# Altium schematic sheet Open lid.SchDoc
size A
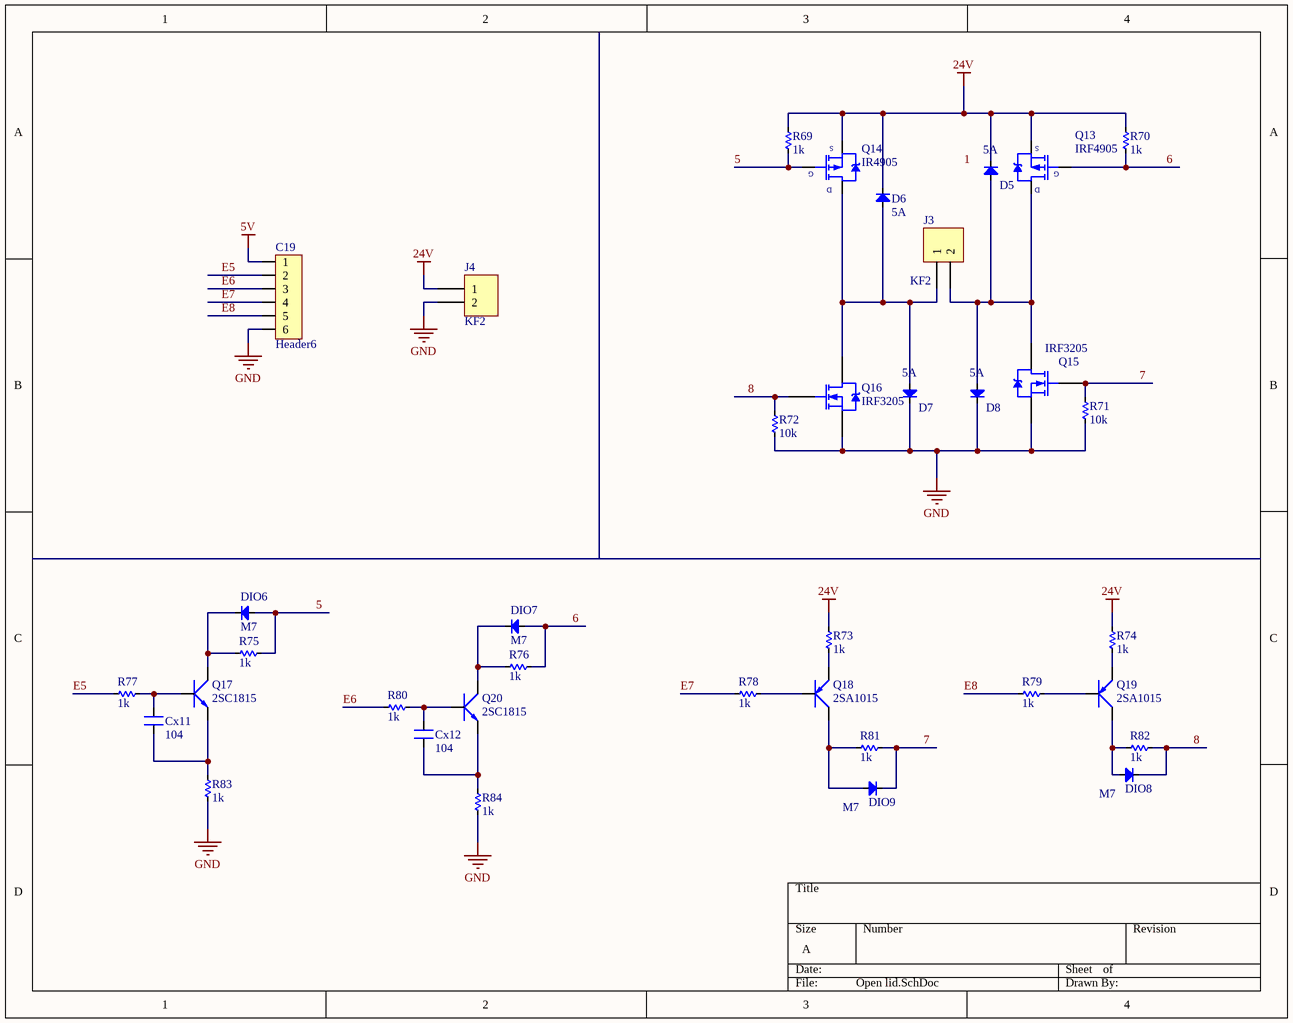
[diagram p0: Open lid.SchDoc]

## Parts
C19  Header6  [HDR6]
Cx11  104  [CN-SMD-0805]
Cx12  104  [CN-SMD-0805]
D5  5A  [DIO-5A]
D6  5A  [DIO-5A]
D7  5A  [DIO-5A]
D8  5A  [DIO-5A]
DIO6  M7  [DIO-SMD-106]
DIO7  M7  [DIO-SMD-106]
DIO8  M7  [DIO-SMD-106]
DIO9  M7  [DIO-SMD-106]
J3  KF2  [KF2-7.62]
J4  KF2  [KF2-7.62]
Q13  IRF4905  [TO220-123]
Q14  IR4905  [TO220-123]
Q15  IRF3205  [TO220-123]
Q16  IRF3205  [TO220-123]
Q17  2SC1815  [SOT23-321]
Q18  2SA1015  [SOT23-321]
Q19  2SA1015  [SOT23-321]
Q20  2SC1815  [SOT23-321]
R69  1k  [RES-1/4W-SMALL]
R70  1k  [RES-1/4W-SMALL]
R71  10k  [RES-1/4W-SMALL]
R72  10k  [RES-1/4W-SMALL]
R73  1k  [RES-SMD-0805]
R74  1k  [RES-SMD-0805]
R75  1k  [RES-SMD-0805]
R76  1k  [RES-SMD-0805]
R77  1k  [RES-SMD-0805]
R78  1k  [RES-SMD-0805]
R79  1k  [RES-SMD-0805]
R80  1k  [RES-SMD-0805]
R81  1k  [RES-SMD-0805]
R82  1k  [RES-SMD-0805]
R83  1k  [RES-SMD-0805]
R84  1k  [RES-SMD-0805]

## Nets
5V: C19.1
24V: D5.2(K) D6.2(K) J4.1 Q13.3(S) Q14.3(S) R69.1 R70.1 R73.1 R74.1
GND: C19.6 D7.2(K) D8.2(K) J4.2 Q15.3(S) Q16.3(S) R71.2 R72.2 R83.2 R84.2
5: DIO6.1(A) Q14.1(G) R69.2 R75.1
6: DIO7.1(A) Q13.1(G) R70.2 R76.1
7: DIO9.2(K) Q15.1(G) R71.1 R81.1
8: DIO8.2(K) Q16.1(G) R72.1 R82.1
E5: C19.2 R77.2
E6: C19.3 R80.2
E7: C19.4 R78.2
E8: C19.5 R79.2
NetCx11_1: Cx11.1 Q17.1(E) R83.1
NetCx11_2: Cx11.2 Q17.3(B) R77.1
NetCx12_1: Cx12.1 Q20.1(E) R84.1
NetCx12_2: Cx12.2 Q20.3(B) R80.1
NetD5_1: D5.1(A) D8.1(A) J3.2 Q13.2(D) Q15.2(D)
NetD6_1: D6.1(A) D7.1(A) J3.1 Q14.2(D) Q16.2(D)
NetDIO6_2: DIO6.2(K) Q17.2(C) R75.2
NetDIO7_2: DIO7.2(K) Q20.2(C) R76.2
NetDIO8_1: DIO8.1(A) Q19.2(C) R82.2
NetDIO9_1: DIO9.1(A) Q18.2(C) R81.2
NetQ18_1: Q18.1(E) R73.2
NetQ18_3: Q18.3(B) R78.1
NetQ19_1: Q19.1(E) R74.2
NetQ19_3: Q19.3(B) R79.1

## Notes on the sheet
- Labels drawn without touching a wire or pin: 1

## Library data of the parts
C19 = Header6: Header IDC, 6 x 1 Pin Vertical 2.54mm Pitch (Non-Boxed, Male); Manufacturer: W¨¹rth Elektronik eiSos GmbH; partNo: 613002143121; ComponentLink1 Description: Manufacturer; ComponentLink2 Description: Datasheet; NoPins: 02; Created Date: 29 March 2013; ComponentLink1URL: http://www.we-online.com; ComponentLink2URL: http://katalog.we-online.de/em/datasheet/6130xx143121.pdf; Created by: Karrer Zheng
Cx11 Cx12 = CN: Value: 33pF
D5-D8 = Diode: Default Diode; Code - JEDEC: DO-214-AB; Value: 1N5007; Published: 8-Jun-2000; Revision: July-2002: Re-released for DXP Platform.; Publisher: Altium Limited
DIO6-DIO9 = Diode SMD: Default Diode; Code - JEDEC: DO-214-AB; Value: 1N5007; Published: 8-Jun-2000; Revision: July-2002: Re-released for DXP Platform.; Publisher: Altium Limited
J3 J4 = KF2: Manufacturer: Würth Elektronik eiSos GmbH; partNo: 691103110002; ComponentLink1 Description: Manufacturer; ComponentLink2 Description: Datasheet; NoPins: 2; Created Date: 29 October 2013; ComponentLink1URL: http://www.we-online.com; ComponentLink2URL: http://katalog.we-online.de/em/datasheet/6911031100xx.pdf; Created by: Karrer Zheng
Q13 Q14 = IRF9540: HEXFET P-Channel Power MOSFET; Value: IRF840
Q15 Q16 = IRFZ44: Value: IRF840
Q17 Q20 = 2SC1815: NPN 600mW, ECB; Value: C1815
Q18 Q19 = 2SA1015: PNP 600mW, ECB; Value: A1015
R69-R72 = Res: Manufacturer: Generic Components; Class: Passive; SubClass: R; Published: 08/06/2000; Publisher: Altium Hobart Technology Centre
R73-R84 = Res-SMD: Resistor; Manufacturer: Generic Components; Class: Passive; Published: 08/06/2000; Publisher: Altium Hobart Technology Centre